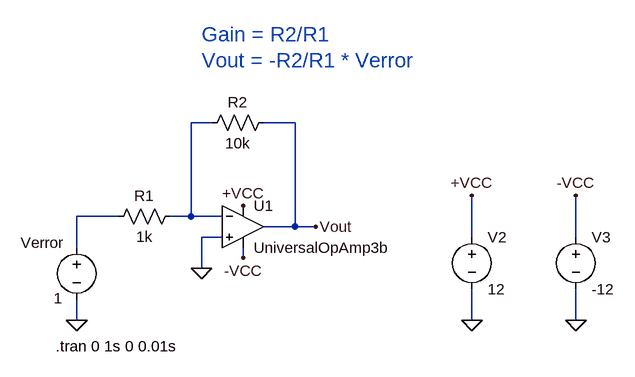
[diagram p0: schematic P Controller.asc]
P Controller.asc, the LTspice schematic file:
Version 4
SHEET 1 880 680
WIRE 144 16 112 16
WIRE 272 16 224 16
WIRE 0 160 -64 160
WIRE 112 160 112 16
WIRE 112 160 80 160
WIRE 160 160 112 160
WIRE 272 176 272 16
WIRE 272 176 224 176
WIRE 304 176 272 176
WIRE 160 192 128 192
WIRE 544 192 544 128
WIRE 704 192 704 128
WIRE -64 208 -64 160
WIRE 192 224 192 208
WIRE 128 240 128 192
WIRE -64 320 -64 288
WIRE 544 320 544 272
WIRE 704 320 704 272
FLAG -64 320 0
FLAG 128 240 0
FLAG 544 320 0
FLAG 704 320 0
FLAG 544 128 +VCC
FLAG 704 128 -VCC
FLAG 192 144 +VCC
FLAG 192 224 -VCC
FLAG 304 176 Vout
SYMBOL OpAmps\\UniversalOpAmp3b 192 176 R0
SYMATTR InstName U1
SYMBOL res 96 144 R90
WINDOW 0 0 56 VBottom 2
WINDOW 3 32 56 VTop 2
SYMATTR InstName R1
SYMATTR Value 1k
SYMBOL res 240 0 R90
WINDOW 0 0 56 VBottom 2
WINDOW 3 32 56 VTop 2
SYMATTR InstName R2
SYMATTR Value 10k
SYMBOL voltage -64 192 R0
WINDOW 0 -86 9 Left 2
WINDOW 3 -35 94 Left 2
WINDOW 123 0 0 Left 0
WINDOW 39 0 0 Left 0
SYMATTR InstName Verror
SYMATTR Value 1
SYMBOL voltage 544 176 R0
WINDOW 123 0 0 Left 0
WINDOW 39 0 0 Left 0
SYMATTR InstName V2
SYMATTR Value 12
SYMBOL voltage 704 176 R0
WINDOW 123 0 0 Left 0
WINDOW 39 0 0 Left 0
SYMATTR InstName V3
SYMATTR Value -12
TEXT 128 -120 Left 3 ;Gain = R2/R1
TEXT -96 360 Left 2 !.tran 0 1s 0 0.01s
TEXT 128 -80 Left 3 ;Vout = -R2/R1 * Verror

The netlist it stands for:
* P Controller.asc
* U1: UniversalOpAmp3b (symbol OpAmps\UniversalOpAmp3b not available, pins judged from their places): In+=0 In-=N001 V+=+VCC V-=-VCC OUT=Vout
R1 N001 N002 1k
R2 Vout N001 10k
Verror N002 0 1
V2 +VCC 0 12
V3 -VCC 0 -12
* Gain = R2/R1
.tran 0 1s 0 0.01s
* Vout = -R2/R1 * Verror
.backanno
.end